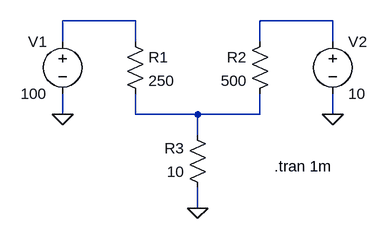
[diagram p0: schematic ground_loop.asc]
ground_loop.asc, the LTspice schematic file:
Version 4
SHEET 1 880 680
WIRE 320 208 208 208
WIRE 624 208 512 208
WIRE 208 240 208 208
WIRE 320 240 320 208
WIRE 512 240 512 208
WIRE 624 240 624 208
WIRE 208 352 208 320
WIRE 320 352 320 320
WIRE 416 352 320 352
WIRE 512 352 512 320
WIRE 512 352 416 352
WIRE 624 352 624 320
WIRE 416 384 416 352
WIRE 416 496 416 464
FLAG 416 496 0
FLAG 208 352 0
FLAG 624 352 0
SYMBOL voltage 208 224 M0
WINDOW 123 0 0 Left 0
WINDOW 39 0 0 Left 0
SYMATTR InstName V1
SYMATTR Value 100
SYMBOL voltage 624 224 R0
WINDOW 123 0 0 Left 0
WINDOW 39 0 0 Left 0
SYMATTR InstName V2
SYMATTR Value 10
SYMBOL res 304 224 R0
SYMATTR InstName R1
SYMATTR Value 250
SYMBOL res 528 224 M0
SYMATTR InstName R2
SYMATTR Value 500
SYMBOL res 432 480 R180
WINDOW 0 36 76 Left 2
WINDOW 3 36 40 Left 2
SYMATTR InstName R3
SYMATTR Value 10
TEXT 534 432 Left 2 !.tran 1m

The netlist it stands for:
* ground_loop.asc
V1 N001 0 100
V2 N002 0 10
R1 N001 N003 250
R2 N002 N003 500
R3 0 N003 10
.tran 1m
.backanno
.end